# Altium schematic sheet AudioCodec_Polyphonic.schdoc
size B; Organization: Altium Limited; Address1: L3, 12a Rodborough Rd; Address2: Frenchs Forest; Address3: NSW; Address4: Australia 2086; DocumentNumber: 1; SheetNumber: 1; SheetTotal: 9
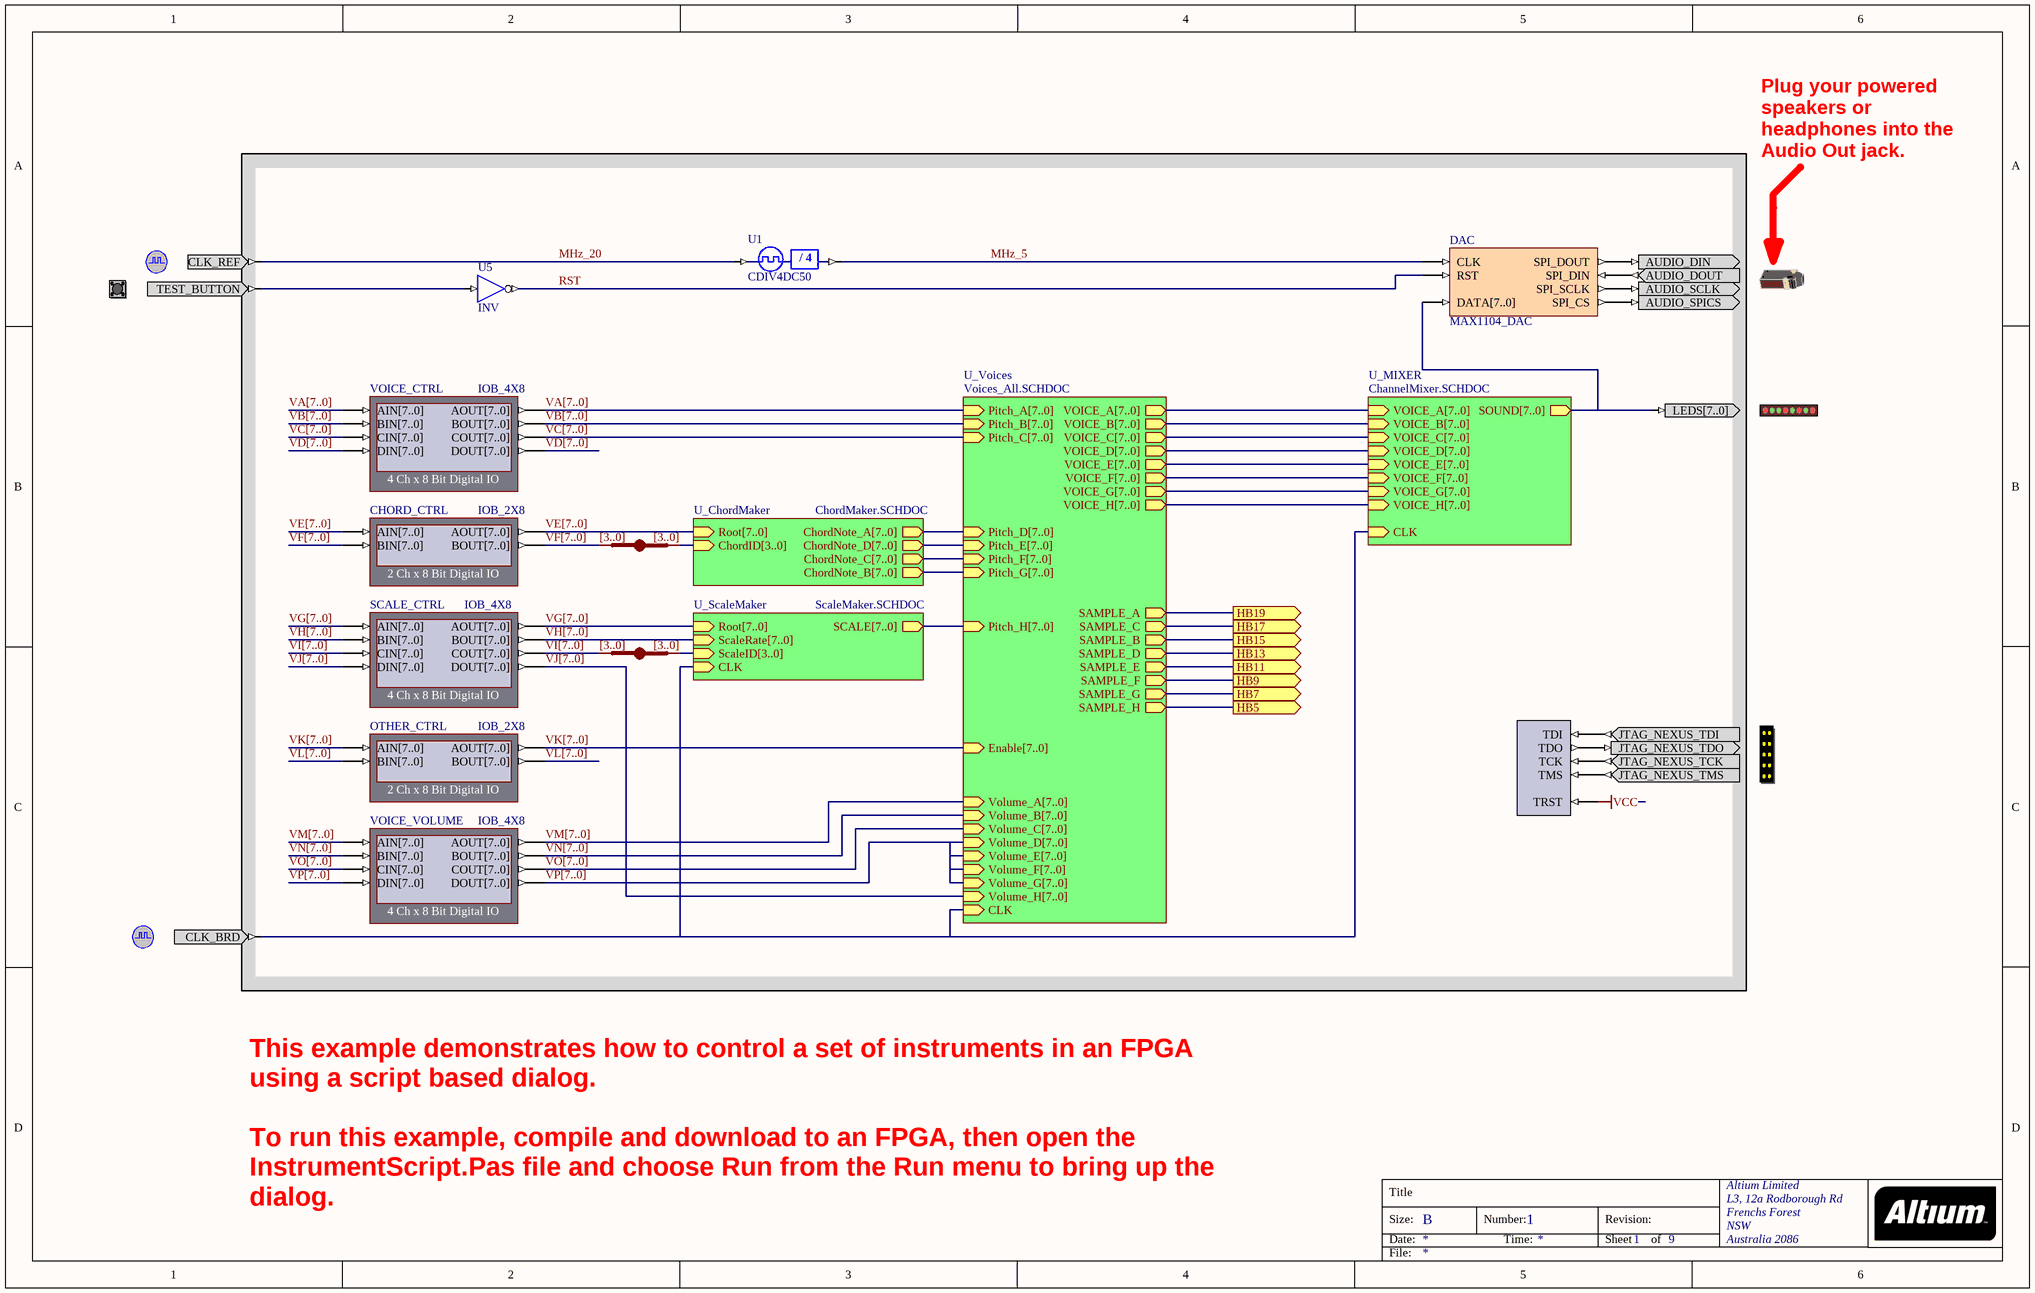
[diagram p0: AudioCodec_Polyphonic.schdoc]

## Parts
(Parts that share a designator on the sheet are numbered #1, #2 ... from top to bottom, then left to right.)
?#1  CLOCK_REFERENCE  (value not drawn)
?#2  TEST_BUTTON  (value not drawn)
?#3  AUDIO_DAC  (value not drawn)
?#4  LED  (value not drawn)
?#5  NEXUS_JTAG_CONNECTOR  (value not drawn)
?#6  CLOCK_BOARD  (value not drawn)
CHORD_CTRL  IOB_2X8
DAC  MAX1104_DAC
JB_AUTO?#1  IndexA: [3..0]  (hidden comment: JB)
JB_AUTO?#2  IndexA: [3..0]  (hidden comment: JB)
NEXUS_JTAG_PORT  NEXUS_JTAG_PORT  (value not drawn)
OTHER_CTRL  IOB_2X8
SCALE_CTRL  IOB_4X8
U1  CDIV4DC50
U5  INV
VOICE_CTRL  IOB_4X8
VOICE_VOLUME  IOB_4X8

## Sub-sheets
U_ChordMaker = ChordMaker.SCHDOC: ChordNote_A[7..0] (out), ChordID[3..0] (in), ChordNote_B[7..0] (out), ChordNote_C[7..0] (out), ChordNote_D[7..0] (out), Root[7..0] (in)
U_MIXER = ChannelMixer.SCHDOC: SOUND[7..0] (out), VOICE_A[7..0] (in), VOICE_B[7..0] (in), VOICE_C[7..0] (in), VOICE_D[7..0] (in), VOICE_E[7..0] (in), VOICE_H[7..0] (in), VOICE_F[7..0] (in), VOICE_G[7..0] (in), CLK (in)
U_ScaleMaker = ScaleMaker.SCHDOC: Root[7..0] (in), ScaleID[3..0] (in), SCALE[7..0] (out), CLK (in), ScaleRate[7..0] (in)
U_Voices = Voices_All.SCHDOC: VOICE_A[7..0] (out), VOICE_B[7..0] (out), SAMPLE_B (out), SAMPLE_A (out), VOICE_C[7..0] (out), VOICE_D[7..0] (out), SAMPLE_D (out), SAMPLE_C (out), Pitch_B[7..0] (in), Enable[7..0] (in), Pitch_C[7..0] (in), CLK (in), Pitch_A[7..0] (in), Pitch_D[7..0] (in), Pitch_E[7..0] (in), Pitch_G[7..0] (in), Pitch_F[7..0] (in), Pitch_H[7..0] (in), SAMPLE_F (out), SAMPLE_E (out), SAMPLE_G (out), SAMPLE_H (out), VOICE_G[7..0] (out), VOICE_E[7..0] (out), VOICE_F[7..0] (out), VOICE_H[7..0] (out), Volume_A[7..0] (in), Volume_B[7..0] (in), Volume_C[7..0] (in), Volume_D[7..0] (in), Volume_E[7..0] (in), Volume_F[7..0] (in), Volume_G[7..0] (in), Volume_H[7..0] (in)

## Ports
HB5 (out), HB7 (out), HB9 (out), HB11 (out), HB13 (out), HB15 (out), HB17 (out), HB19 (out)

## Nets
VCC: NEXUS_JTAG_PORT.TRST
HB5: port HB5, sheet U_Voices/SAMPLE_H
HB7: port HB7, sheet U_Voices/SAMPLE_G
HB9: port HB9, sheet U_Voices/SAMPLE_F
HB11: port HB11, sheet U_Voices/SAMPLE_E
HB13: port HB13, sheet U_Voices/SAMPLE_D
HB15: port HB15, sheet U_Voices/SAMPLE_B
HB17: port HB17, sheet U_Voices/SAMPLE_C
HB19: port HB19, sheet U_Voices/SAMPLE_A
MHz_5: DAC.CLK U1.CLKDV
MHz_20: ?#1.CLK_REF U1.CLKIN
RST: DAC.RST U5.O
VA[7..0]: VOICE_CTRL.AIN[7..0] VOICE_CTRL.AOUT[7..0] ; sheet U_Voices/Pitch_A[7..0]
VB[7..0]: VOICE_CTRL.BIN[7..0] VOICE_CTRL.BOUT[7..0] ; sheet U_Voices/Pitch_B[7..0]
VC[7..0]: VOICE_CTRL.CIN[7..0] VOICE_CTRL.COUT[7..0] ; sheet U_Voices/Pitch_C[7..0]
VD[7..0]: VOICE_CTRL.DIN[7..0] VOICE_CTRL.DOUT[7..0]
VE[7..0]: CHORD_CTRL.AIN[7..0] CHORD_CTRL.AOUT[7..0] ; sheet U_ChordMaker/Root[7..0]
VF[7..0]: CHORD_CTRL.BIN[7..0] CHORD_CTRL.BOUT[7..0] JB_AUTO?#1.A[0..0]
VG[7..0]: SCALE_CTRL.AIN[7..0] SCALE_CTRL.AOUT[7..0] ; sheet U_ScaleMaker/Root[7..0]
VH[7..0]: SCALE_CTRL.BIN[7..0] SCALE_CTRL.BOUT[7..0] ; sheet U_ScaleMaker/ScaleRate[7..0]
VI[7..0]: JB_AUTO?#2.A[0..0] SCALE_CTRL.CIN[7..0] SCALE_CTRL.COUT[7..0]
VJ[7..0]: SCALE_CTRL.DIN[7..0] SCALE_CTRL.DOUT[7..0] ; sheet U_Voices/Volume_H[7..0]
VK[7..0]: OTHER_CTRL.AIN[7..0] OTHER_CTRL.AOUT[7..0] ; sheet U_Voices/Enable[7..0]
VL[7..0]: OTHER_CTRL.BIN[7..0] OTHER_CTRL.BOUT[7..0]
VM[7..0]: VOICE_VOLUME.AIN[7..0] VOICE_VOLUME.AOUT[7..0] ; sheet U_Voices/Volume_A[7..0]
VN[7..0]: VOICE_VOLUME.BIN[7..0] VOICE_VOLUME.BOUT[7..0] ; sheet U_Voices/Volume_B[7..0]
VO[7..0]: VOICE_VOLUME.CIN[7..0] VOICE_VOLUME.COUT[7..0] ; sheet U_Voices/Volume_C[7..0]
VP[7..0]: VOICE_VOLUME.DIN[7..0] VOICE_VOLUME.DOUT[7..0] ; sheet U_Voices/Volume_D[7..0], sheet U_Voices/Volume_E[7..0], sheet U_Voices/Volume_F[7..0], sheet U_Voices/Volume_G[7..0]
Net?#2_TEST_BUTTON: ?#2.TEST_BUTTON U5.I
Net?#3_AUDIO_DIN: ?#3.AUDIO_DIN DAC.SPI_DOUT
Net?#3_AUDIO_DOUT: ?#3.AUDIO_DOUT DAC.SPI_DIN
Net?#3_AUDIO_SCLK: ?#3.AUDIO_SCLK DAC.SPI_SCLK
Net?#3_AUDIO_SPICS: ?#3.AUDIO_SPICS DAC.SPI_CS
Net?#4_LEDS[7..0]: ?#4.LEDS[7..0] DAC.DATA[7..0] ; sheet U_MIXER/SOUND[7..0]
Net?#5_JTAG_NEXUS_TCK: ?#5.JTAG_NEXUS_TCK NEXUS_JTAG_PORT.TCK
Net?#5_JTAG_NEXUS_TDI: ?#5.JTAG_NEXUS_TDI NEXUS_JTAG_PORT.TDI
Net?#5_JTAG_NEXUS_TDO: ?#5.JTAG_NEXUS_TDO NEXUS_JTAG_PORT.TDO
Net?#5_JTAG_NEXUS_TMS: ?#5.JTAG_NEXUS_TMS NEXUS_JTAG_PORT.TMS
Net?#6_CLK_BRD: ?#6.CLK_BRD ; sheet U_Voices/CLK, sheet U_MIXER/CLK, sheet U_ScaleMaker/CLK
NetJB_AUTO?#1_B[0..0]: JB_AUTO?#1.B[0..0] ; sheet U_ChordMaker/ChordID[3..0]
NetJB_AUTO?#2_B[0..0]: JB_AUTO?#2.B[0..0] ; sheet U_ScaleMaker/ScaleID[3..0]

## Buses and harness runs
bus sheet U_ChordMaker/ChordNote_A[7..0] = sheet U_Voices/Pitch_D[7..0]
bus sheet U_ChordMaker/ChordNote_B[7..0] = sheet U_Voices/Pitch_G[7..0]
bus sheet U_ChordMaker/ChordNote_C[7..0] = sheet U_Voices/Pitch_F[7..0]
bus sheet U_ChordMaker/ChordNote_D[7..0] = sheet U_Voices/Pitch_E[7..0]
bus sheet U_MIXER/VOICE_A[7..0] = sheet U_Voices/VOICE_A[7..0]
bus sheet U_MIXER/VOICE_B[7..0] = sheet U_Voices/VOICE_B[7..0]
bus sheet U_MIXER/VOICE_C[7..0] = sheet U_Voices/VOICE_C[7..0]
bus sheet U_MIXER/VOICE_D[7..0] = sheet U_Voices/VOICE_D[7..0]
bus sheet U_MIXER/VOICE_E[7..0] = sheet U_Voices/VOICE_E[7..0]
bus sheet U_MIXER/VOICE_F[7..0] = sheet U_Voices/VOICE_F[7..0]
bus sheet U_MIXER/VOICE_G[7..0] = sheet U_Voices/VOICE_G[7..0]
bus sheet U_MIXER/VOICE_H[7..0] = sheet U_Voices/VOICE_H[7..0]
bus sheet U_ScaleMaker/SCALE[7..0] = sheet U_Voices/Pitch_H[7..0]
bus VA[7..0]
bus VA[7..0] = sheet U_Voices/Pitch_A[7..0]
bus VB[7..0]
bus VB[7..0] = sheet U_Voices/Pitch_B[7..0]
bus VC[7..0]
bus VC[7..0] = sheet U_Voices/Pitch_C[7..0]
bus VD[7..0]
bus VE[7..0]
bus VE[7..0] = sheet U_ChordMaker/Root[7..0]
bus VF[7..0]
bus VG[7..0]
bus VG[7..0] = sheet U_ScaleMaker/Root[7..0]
bus VH[7..0]
bus VH[7..0] = sheet U_ScaleMaker/ScaleRate[7..0]
bus VI[7..0]
bus VJ[7..0]
bus VJ[7..0] = sheet U_Voices/Volume_H[7..0]
bus VK[7..0]
bus VK[7..0] = sheet U_Voices/Enable[7..0]
bus VL[7..0]
bus VM[7..0]
bus VM[7..0] = sheet U_Voices/Volume_A[7..0]
bus VN[7..0]
bus VN[7..0] = sheet U_Voices/Volume_B[7..0]
bus VO[7..0]
bus VO[7..0] = sheet U_Voices/Volume_C[7..0]
bus VP[7..0]
bus VP[7..0] = sheet U_Voices/Volume_D[7..0] = sheet U_Voices/Volume_E[7..0] = sheet U_Voices/Volume_F[7..0] = sheet U_Voices/Volume_G[7..0]

## Notes on the sheet
- Plug your powered speakers or headphones into the Audio Out jack.
- This example demonstrates how to control a set of instruments in an FPGA using a script based dialog.
  To run this example, compile and download to an FPGA, then open the InstrumentScript.Pas file and choose Run from the Run menu to bring up the dialog.
- Title
- Size:
- Date:
- B
- Number:
- Time:
- Revision:
- Sheet
- of
- File:
- (in symbol AUDIO_DAC) .
- (in symbol CDIV4DC50) / 4

## Library data of the parts
?#1 = CLOCK_REFERENCE: Global System Clock Reference Supply; PortComponent: True; Published: 19-Nov-2003; Publisher: Altium Limited
?#2 = TEST_BUTTON: Test Button; PortComponent: True; Published: 19-Nov-2003; Publisher: Altium Limited
?#3 = AUDIO_DAC: Audio Jack; PortComponent: True; Published: 19-Nov-2003; Publisher: Altium Limited
?#4 = LED: 8-Way LEDS; PortComponent: True; Published: 19-Nov-2003; Publisher: Altium Limited
?#5 = NEXUS_JTAG_CONNECTOR: JTAG Port; PortComponent: True; Published: 19-Nov-2003; Publisher: Altium Limited
?#6 = CLOCK_BOARD: Global System Clock Supply; PortComponent: True; Published: 19-Nov-2003; Publisher: Altium Limited
CHORD_CTRL = IOB_2X8: 2 Ch x 8 Bit Digital IO; NEXUS_CORE: Instrument; NEXUS_JTAG_DEVICE: True; NEXUS_JTAG_ORDER: 40; Published: 30/09/2003; Publisher: Altium Hobart Technology Centre; Core Revision: 1.00.00
DAC = MAX1104_DAC: MAX1104 DAC Controller; Published: 3/02/2004; Publisher: Altium Hobart Technology Centre; Core Revision: 1.00.00
JB_AUTO?#1 JB_AUTO?#2 = JB: System BUS Joiner; ArchiveName: GENERIC; Published: 18-Dec-2003; Publisher: Altium Limited; Core Revision: 1.00.00; IndexB: [3..0]
NEXUS_JTAG_PORT = NEXUS_JTAG_PORT: Nexus Processor JTAG Chain Connector; NEXUS_JTAG_CONNECTOR: True; Published: 5-Sep-2003; Publisher: Altium Hobart Technology Centre
OTHER_CTRL = IOB_2X8: 2 Ch x 8 Bit Digital IO; NEXUS_CORE: Instrument; NEXUS_JTAG_DEVICE: True; NEXUS_JTAG_ORDER: 0; Published: 30/09/2003; Publisher: Altium Hobart Technology Centre; Core Revision: 1.00.00
SCALE_CTRL VOICE_VOLUME = IOB_4X8: 4 Ch x 8 Bit Digital IO; NEXUS_CORE: Instrument; NEXUS_JTAG_DEVICE: True; NEXUS_JTAG_ORDER: 20; Published: 30/09/2003; Publisher: Altium Hobart Technology Centre; Core Revision: 1.00.00
U1 = CDIV4DC50: Clock Divider by 4 with 50% Duty Cycle Output; Xilinx Equivalent: CLK_DIV4; ArchiveName: GENERIC; VHDLIB_SIM: GENERIC_LIB; Published: 29-Jan-2004; Publisher: Altium Limited; Core Revision: 1.00.00
U5 = INV: Inverter; ArchiveName: GENERIC; Published: 18-Dec-2003; Publisher: Altium Limited; Xilinx Equivalent: INV; Core Revision: 1.00.00
VOICE_CTRL = IOB_4X8: 4 Ch x 8 Bit Digital IO; NEXUS_CORE: Instrument; NEXUS_JTAG_DEVICE: True; NEXUS_JTAG_ORDER: 10; Published: 30/09/2003; Publisher: Altium Hobart Technology Centre; Core Revision: 1.00.00